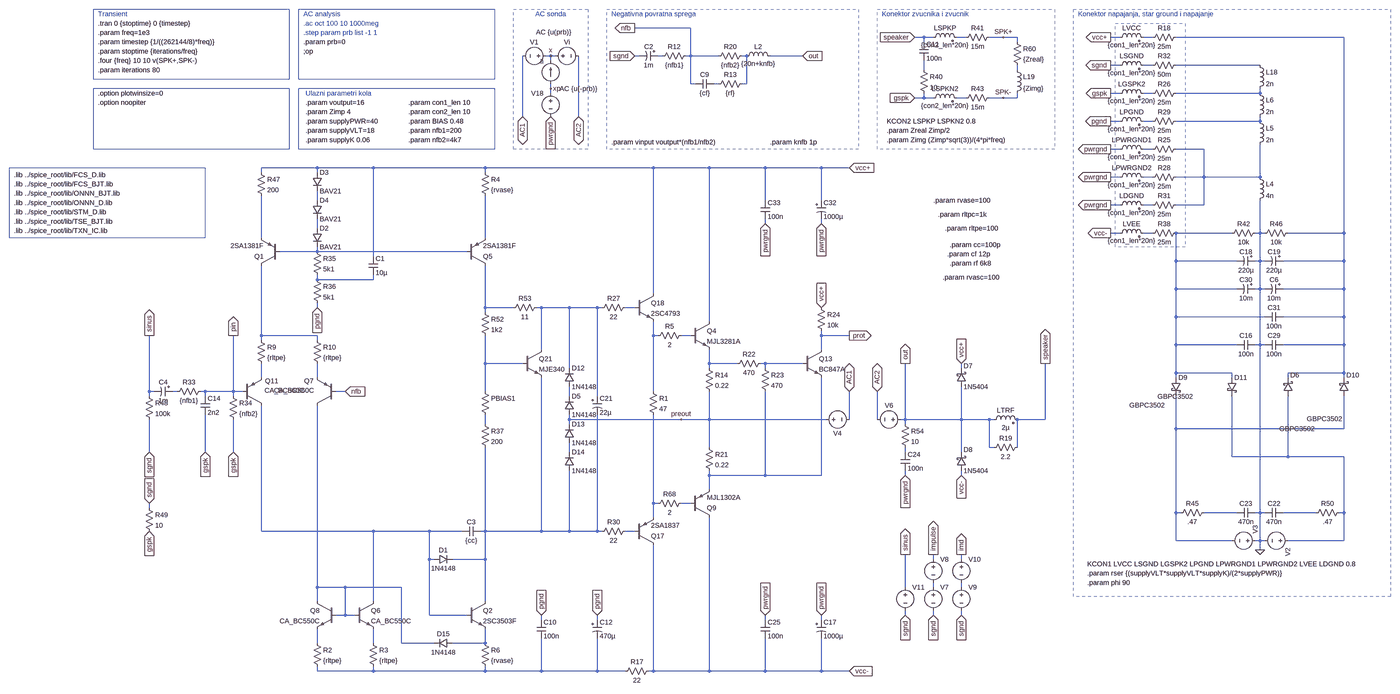
[diagram p0: schematic pab3bbb-arguo-sym.asc, whole sheet]
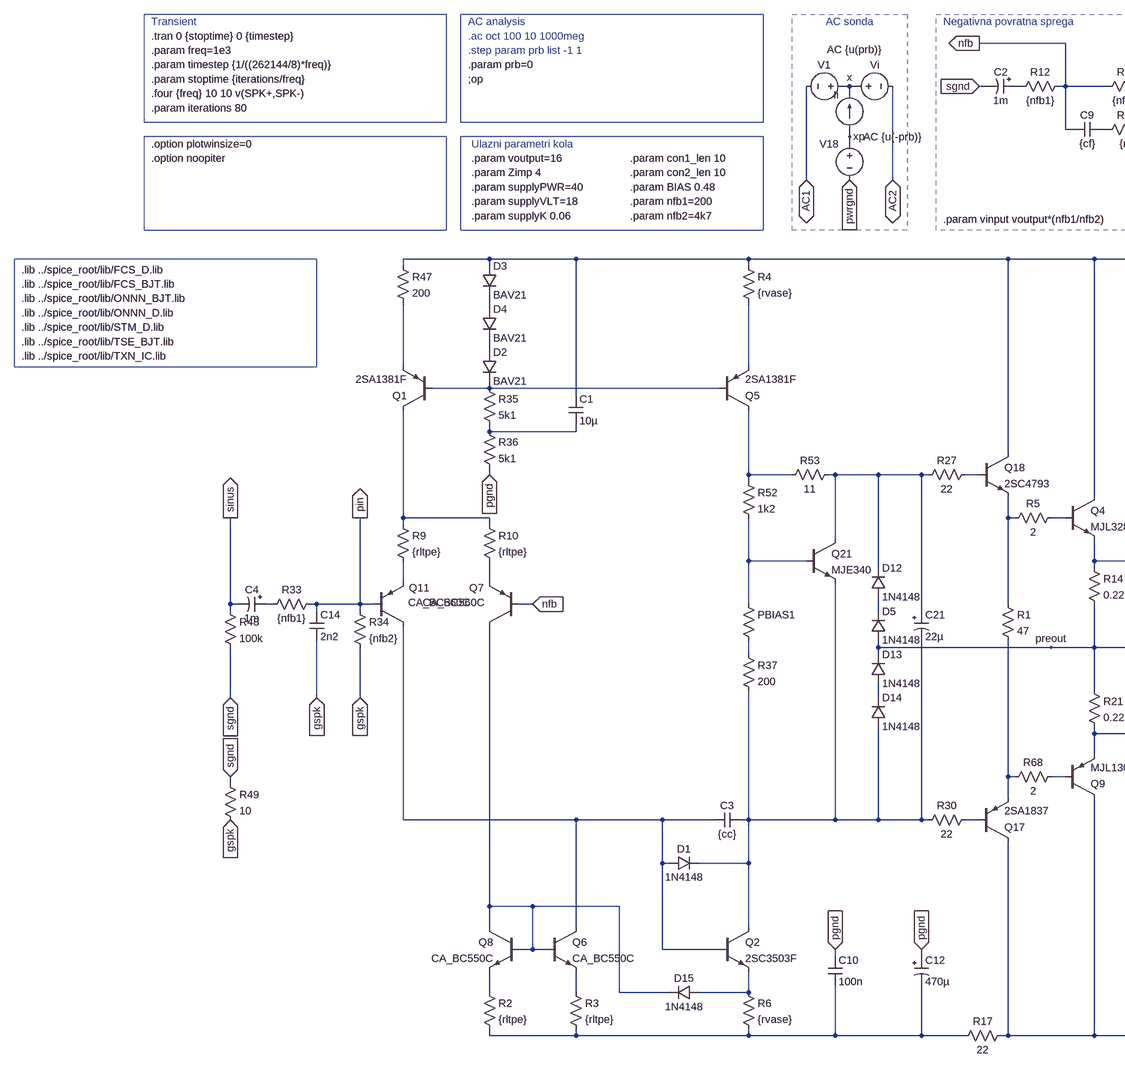
[diagram p1: schematic pab3bbb-arguo-sym.asc, part, row 1 of 1, column 1 of 2]
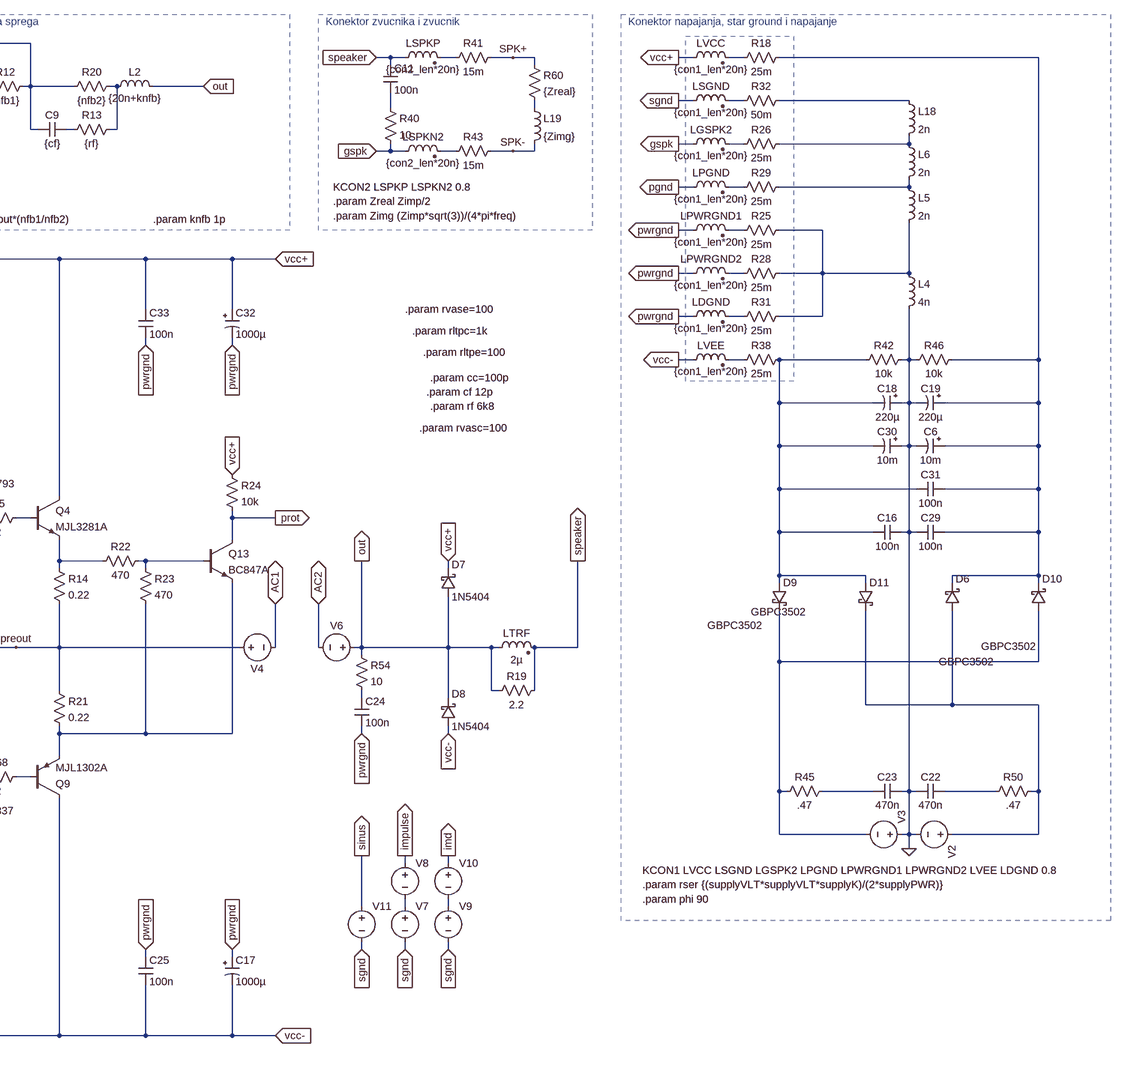
[diagram p2: schematic pab3bbb-arguo-sym.asc, part, row 1 of 1, column 2 of 2]
pab3bbb-arguo-sym.asc, the LTspice schematic file:
Version 4
SHEET 1 6124 2336
WIRE 1472 -1568 1280 -1568
WIRE 2272 -1536 2240 -1536
WIRE 2304 -1536 2272 -1536
WIRE 2416 -1536 2384 -1536
WIRE 2544 -1536 2496 -1536
WIRE 2592 -1536 2544 -1536
WIRE 2944 -1536 2912 -1536
WIRE 3056 -1536 3024 -1536
WIRE 3712 -1536 3136 -1536
WIRE 2272 -1520 2272 -1536
WIRE 2592 -1520 2592 -1536
WIRE 992 -1472 976 -1472
WIRE 1008 -1472 992 -1472
WIRE 1296 -1472 1280 -1472
WIRE 1376 -1472 1360 -1472
WIRE 1472 -1472 1472 -1568
WIRE 1472 -1472 1456 -1472
WIRE 1568 -1472 1472 -1472
WIRE 1664 -1472 1648 -1472
WIRE 1856 -1472 1744 -1472
WIRE 992 -1456 992 -1472
WIRE 2944 -1440 2912 -1440
WIRE 3056 -1440 3024 -1440
WIRE 3424 -1440 3136 -1440
WIRE 2272 -1424 2272 -1456
WIRE 2592 -1424 2592 -1440
WIRE 1472 -1376 1472 -1472
WIRE 1488 -1376 1472 -1376
WIRE 1568 -1376 1552 -1376
WIRE 1664 -1376 1664 -1472
WIRE 1664 -1376 1648 -1376
WIRE 992 -1360 992 -1376
WIRE 992 -1344 992 -1360
WIRE 2944 -1344 2912 -1344
WIRE 3056 -1344 3024 -1344
WIRE 3424 -1344 3424 -1360
WIRE 3424 -1344 3136 -1344
WIRE 2272 -1328 2272 -1344
WIRE 2272 -1328 2240 -1328
WIRE 2304 -1328 2272 -1328
WIRE 2416 -1328 2384 -1328
WIRE 2544 -1328 2496 -1328
WIRE 2592 -1328 2592 -1344
WIRE 2592 -1328 2544 -1328
WIRE 896 -1264 896 -1472
WIRE 1088 -1264 1088 -1472
WIRE 2944 -1248 2912 -1248
WIRE 3056 -1248 3024 -1248
WIRE 3424 -1248 3424 -1264
WIRE 3424 -1248 3136 -1248
WIRE 2944 -1152 2912 -1152
WIRE 3056 -1152 3024 -1152
WIRE 3232 -1152 3136 -1152
WIRE 192 -1088 0 -1088
WIRE 384 -1088 192 -1088
WIRE 768 -1088 384 -1088
WIRE 1344 -1088 768 -1088
WIRE 1536 -1088 1344 -1088
WIRE 1728 -1088 1536 -1088
WIRE 1920 -1088 1728 -1088
WIRE 2016 -1088 1920 -1088
WIRE 0 -1072 0 -1088
WIRE 192 -1072 192 -1088
WIRE 768 -1072 768 -1088
WIRE 2944 -1056 2912 -1056
WIRE 3056 -1056 3024 -1056
WIRE 3232 -1056 3232 -1152
WIRE 3232 -1056 3136 -1056
WIRE 3424 -1056 3424 -1168
WIRE 3424 -1056 3232 -1056
WIRE 192 -976 192 -1008
WIRE 1728 -976 1728 -1088
WIRE 1920 -976 1920 -1088
WIRE 2944 -960 2912 -960
WIRE 3056 -960 3024 -960
WIRE 3232 -960 3232 -1056
WIRE 3232 -960 3136 -960
WIRE 1728 -896 1728 -912
WIRE 1920 -896 1920 -912
WIRE 192 -880 192 -912
WIRE 2944 -864 2912 -864
WIRE 3056 -864 3024 -864
WIRE 3328 -864 3136 -864
WIRE 3424 -864 3424 -976
WIRE 3424 -864 3408 -864
WIRE 3440 -864 3424 -864
WIRE 3712 -864 3712 -1536
WIRE 3712 -864 3520 -864
WIRE 0 -848 0 -992
WIRE 768 -848 768 -992
WIRE 192 -800 192 -816
WIRE 192 -800 64 -800
WIRE 704 -800 192 -800
WIRE 384 -784 384 -1088
WIRE 3136 -768 3136 -864
WIRE 3344 -768 3136 -768
WIRE 3424 -768 3424 -864
WIRE 3424 -768 3408 -768
WIRE 3440 -768 3424 -768
WIRE 3712 -768 3712 -864
WIRE 3712 -768 3504 -768
WIRE 192 -704 192 -720
WIRE 384 -704 384 -720
WIRE 384 -704 192 -704
WIRE 3136 -672 3136 -768
WIRE 3344 -672 3136 -672
WIRE 3424 -672 3424 -768
WIRE 3424 -672 3408 -672
WIRE 3440 -672 3424 -672
WIRE 3712 -672 3712 -768
WIRE 3712 -672 3504 -672
WIRE 1344 -656 1344 -1088
WIRE 192 -608 192 -624
WIRE 768 -608 768 -752
WIRE 864 -608 768 -608
WIRE 960 -608 944 -608
WIRE 1056 -608 960 -608
WIRE 1152 -608 1056 -608
WIRE 1168 -608 1152 -608
WIRE 1280 -608 1248 -608
WIRE 768 -592 768 -608
WIRE 3136 -576 3136 -672
WIRE 3440 -576 3136 -576
WIRE 3712 -576 3712 -672
WIRE 3712 -576 3504 -576
WIRE 1536 -560 1536 -1088
WIRE 0 -512 0 -752
WIRE 192 -512 0 -512
WIRE 1344 -512 1344 -560
WIRE 1360 -512 1344 -512
WIRE 1472 -512 1440 -512
WIRE 1920 -512 1920 -528
WIRE 2016 -512 1920 -512
WIRE 0 -496 0 -512
WIRE 192 -496 192 -512
WIRE 3136 -480 3136 -576
WIRE 3344 -480 3136 -480
WIRE 3424 -480 3424 -672
WIRE 3424 -480 3408 -480
WIRE 3440 -480 3424 -480
WIRE 3712 -480 3712 -576
WIRE 3712 -480 3504 -480
WIRE 960 -464 960 -608
WIRE 1920 -464 1920 -512
WIRE 768 -416 768 -512
WIRE 896 -416 768 -416
WIRE 1536 -416 1536 -464
WIRE 1632 -416 1536 -416
WIRE 1728 -416 1712 -416
WIRE 1856 -416 1728 -416
WIRE 1056 -400 1056 -608
WIRE 1536 -400 1536 -416
WIRE 1728 -400 1728 -416
WIRE 2400 -400 2400 -416
WIRE 3136 -384 3136 -480
WIRE 3328 -384 3136 -384
WIRE 3712 -384 3712 -480
WIRE 3712 -384 3520 -384
WIRE 0 -368 0 -416
WIRE 192 -368 192 -416
WIRE 3136 -368 3136 -384
WIRE 3328 -368 3328 -384
WIRE 3520 -368 3520 -384
WIRE 3712 -368 3712 -384
WIRE -384 -320 -384 -512
WIRE -368 -320 -384 -320
WIRE -288 -320 -304 -320
WIRE -192 -320 -208 -320
WIRE -96 -320 -96 -512
WIRE -96 -320 -192 -320
WIRE -64 -320 -96 -320
WIRE 288 -320 256 -320
WIRE 768 -320 768 -416
WIRE 1344 -320 1344 -512
WIRE -384 -304 -384 -320
WIRE -192 -304 -192 -320
WIRE -96 -304 -96 -320
WIRE 1056 -304 1056 -336
WIRE 1152 -304 1152 -608
WIRE 1056 -224 1056 -240
WIRE 1440 -224 1056 -224
WIRE 1536 -224 1536 -320
WIRE 1536 -224 1440 -224
WIRE 1936 -224 1536 -224
WIRE 2016 -224 2016 -320
WIRE 2112 -224 2112 -320
WIRE 2208 -224 2208 -416
WIRE 2208 -224 2192 -224
WIRE 2400 -224 2400 -336
WIRE 2400 -224 2208 -224
WIRE 2496 -224 2400 -224
WIRE 2512 -224 2496 -224
WIRE 2688 -224 2688 -416
WIRE 2688 -224 2592 -224
WIRE 768 -208 768 -240
WIRE 1056 -208 1056 -224
WIRE 2208 -208 2208 -224
WIRE 3136 -192 3136 -304
WIRE 3712 -192 3712 -304
WIRE 3712 -192 3136 -192
WIRE 1536 -128 1536 -224
WIRE 2496 -128 2496 -224
WIRE 2512 -128 2496 -128
WIRE 2592 -128 2592 -224
WIRE -384 -112 -384 -224
WIRE -192 -112 -192 -240
WIRE -96 -112 -96 -224
WIRE 1056 -112 1056 -144
WIRE 2208 -112 2208 -128
WIRE 2400 -112 2400 -224
WIRE 3328 -96 3328 -304
WIRE 3520 -96 3520 -304
WIRE 3520 -96 3328 -96
WIRE 3712 -96 3520 -96
WIRE 1536 -32 1536 -48
WIRE 1728 -32 1728 -320
WIRE 1728 -32 1536 -32
WIRE 1920 -32 1920 -368
WIRE 1920 -32 1728 -32
WIRE 2208 -32 2208 -48
WIRE 2400 -32 2400 -48
WIRE 1536 16 1536 -32
WIRE 1344 64 1344 -240
WIRE 1360 64 1344 64
WIRE 1472 64 1440 64
WIRE -384 80 -384 64
WIRE 3136 96 3136 -192
WIRE 3152 96 3136 96
WIRE 3344 96 3232 96
WIRE 3424 96 3424 -480
WIRE 3424 96 3408 96
WIRE 3440 96 3424 96
WIRE 3616 96 3504 96
WIRE 3712 96 3712 -96
WIRE 3712 96 3696 96
WIRE 1344 112 1344 64
WIRE 0 160 0 -272
WIRE 384 160 0 160
WIRE 576 160 384 160
WIRE 688 160 576 160
WIRE 768 160 768 -128
WIRE 768 160 752 160
WIRE 960 160 960 -368
WIRE 960 160 768 160
WIRE 1056 160 1056 -48
WIRE 1056 160 960 160
WIRE 1152 160 1152 -240
WIRE 1152 160 1056 160
WIRE 1168 160 1152 160
WIRE 1280 160 1248 160
WIRE 3136 192 3136 96
WIRE 3328 192 3136 192
WIRE 3424 192 3424 96
WIRE 3424 192 3408 192
WIRE 3440 192 3424 192
WIRE 3712 192 3712 96
WIRE 3712 192 3520 192
WIRE 3424 224 3424 192
WIRE 576 256 576 160
WIRE 592 256 576 256
WIRE 768 256 768 160
WIRE 768 256 656 256
WIRE 2304 256 2304 240
WIRE 2400 256 2400 240
WIRE 192 352 192 -272
WIRE 288 352 192 352
WIRE 480 352 288 352
WIRE 2208 352 2208 240
WIRE 2304 352 2304 336
WIRE 2400 352 2400 336
WIRE 192 400 192 352
WIRE 384 400 384 160
WIRE 768 400 768 256
WIRE 288 448 288 352
WIRE 288 448 256 448
WIRE 320 448 288 448
WIRE 576 448 576 256
WIRE 704 448 576 448
WIRE 2208 448 2208 432
WIRE 2304 448 2304 432
WIRE 2400 448 2400 432
WIRE 960 464 960 448
WIRE 1152 464 1152 448
WIRE 1728 464 1728 448
WIRE 1920 464 1920 448
WIRE 192 544 192 496
WIRE 384 544 384 496
WIRE 480 544 480 352
WIRE 592 544 480 544
WIRE 768 544 768 496
WIRE 768 544 656 544
WIRE 192 640 192 624
WIRE 384 640 384 624
WIRE 384 640 192 640
WIRE 768 640 768 624
WIRE 768 640 384 640
WIRE 960 640 960 528
WIRE 960 640 768 640
WIRE 1152 640 1152 528
WIRE 1152 640 960 640
WIRE 1248 640 1152 640
WIRE 1344 640 1344 208
WIRE 1344 640 1328 640
WIRE 1536 640 1536 112
WIRE 1536 640 1344 640
WIRE 1728 640 1728 528
WIRE 1728 640 1536 640
WIRE 1920 640 1920 528
WIRE 1920 640 1728 640
WIRE 2016 640 1920 640
FLAG 2016 -1088 vcc+
IOPIN 2016 -1088 In
FLAG 992 -1472 x
FLAG 2016 640 vcc-
IOPIN 2016 640 In
FLAG 2208 -416 out
IOPIN 2208 -416 Out
FLAG 1280 -1568 nfb
IOPIN 1280 -1568 Out
FLAG 288 -320 nfb
IOPIN 288 -320 In
FLAG 992 -1360 xp
FLAG 2208 -32 pwrgnd
IOPIN 2208 -32 In
FLAG 1280 -1472 sgnd
IOPIN 1280 -1472 In
FLAG 2208 448 sgnd
IOPIN 2208 448 In
FLAG 2208 240 sinus
IOPIN 2208 240 Out
FLAG 192 -608 pgnd
IOPIN 192 -608 In
FLAG 2912 -1536 vcc+
IOPIN 2912 -1536 Out
FLAG 2912 -864 vcc-
IOPIN 2912 -864 Out
FLAG 2912 -1344 gspk
IOPIN 2912 -1344 Out
FLAG 2912 -1056 pwrgnd
IOPIN 2912 -1056 Out
FLAG 2912 -1248 pgnd
IOPIN 2912 -1248 Out
FLAG 2912 -1440 sgnd
IOPIN 2912 -1440 Out
FLAG 1856 -1472 out
IOPIN 1856 -1472 In
FLAG 2688 -416 speaker
IOPIN 2688 -416 Out
FLAG 2240 -1328 gspk
IOPIN 2240 -1328 In
FLAG 2240 -1536 speaker
IOPIN 2240 -1536 In
FLAG 2912 -1152 pwrgnd
IOPIN 2912 -1152 Out
FLAG 2304 240 impulse
IOPIN 2304 240 Out
FLAG 2912 -960 pwrgnd
IOPIN 2912 -960 Out
FLAG 3424 224 0
FLAG 896 -1264 AC1
IOPIN 896 -1264 BiDir
FLAG 1088 -1264 AC2
IOPIN 1088 -1264 BiDir
FLAG 2016 -320 AC1
IOPIN 2016 -320 BiDir
FLAG 2112 -320 AC2
IOPIN 2112 -320 BiDir
FLAG 992 -1264 pwrgnd
IOPIN 992 -1264 In
FLAG 2544 -1536 SPK+
FLAG 2544 -1328 SPK-
FLAG 2400 240 imd
IOPIN 2400 240 Out
FLAG 2400 -416 vcc+
IOPIN 2400 -416 In
FLAG 2400 -32 vcc-
IOPIN 2400 -32 In
FLAG 2304 448 sgnd
IOPIN 2304 448 In
FLAG 2400 448 sgnd
IOPIN 2400 448 In
FLAG 1728 448 pwrgnd
IOPIN 1728 448 In
FLAG 1920 448 pwrgnd
IOPIN 1920 448 In
FLAG 1920 -896 pwrgnd
IOPIN 1920 -896 In
FLAG 1728 -896 pwrgnd
IOPIN 1728 -896 In
FLAG -384 -112 sgnd
IOPIN -384 -112 In
FLAG -384 64 sgnd
IOPIN -384 64 In
FLAG -384 160 gspk
IOPIN -384 160 In
FLAG 1440 -224 preout
FLAG -96 -512 pin
IOPIN -96 -512 Out
FLAG 2016 -512 prot
IOPIN 2016 -512 Out
FLAG 1920 -608 vcc+
IOPIN 1920 -608 In
FLAG -384 -512 sinus
IOPIN -384 -512 Out
FLAG -96 -112 gspk
IOPIN -96 -112 In
FLAG -192 -112 gspk
IOPIN -192 -112 In
FLAG 960 448 pgnd
IOPIN 960 448 In
FLAG 1152 448 pgnd
IOPIN 1152 448 In
DATAFLAG 1440 -1088 ""
DATAFLAG 1440 640 ""
DATAFLAG 1344 -896 "Ic(Q18)"
DATAFLAG 0 -672 "-Ic(Q1)"
DATAFLAG 1632 -224 ""
DATAFLAG 1536 -896 "Ic(Q4)"
SYMBOL res 1472 -1488 R90
WINDOW 0 0 56 VBottom 2
WINDOW 3 32 56 VTop 2
SYMATTR InstName R12
SYMATTR Value {nfb1}
SYMBOL voltage 3536 192 R90
WINDOW 123 0 0 Left 2
WINDOW 3 -94 177 Invisible 2
SYMATTR Value SINE(0 {supplyVLT*sqrt(2)} 50 1m 0 {phi})
SYMATTR SpiceLine Rser={rser}
SYMATTR InstName V2
SYMBOL current 992 -1376 R180
WINDOW 0 24 77 Left 2
WINDOW 3 24 0 Invisible 2
WINDOW 123 -71 178 Left 2
WINDOW 39 0 0 Left 2
SYMATTR InstName Ii
SYMATTR Value 0
SYMATTR Value2 AC {u(prb)}
SYMBOL voltage 992 -1472 R270
WINDOW 0 32 56 VTop 2
WINDOW 3 -32 56 Invisible 2
WINDOW 123 -97 96 VBottom 2
WINDOW 39 -32 56 VBottom 2
SYMATTR InstName Vi
SYMATTR Value 0
SYMATTR Value2 AC {u(-prb)}
SYMBOL pnp -64 -272 M180
WINDOW 0 77 84 Left 2
WINDOW 3 75 52 Left 2
SYMATTR InstName Q11
SYMATTR Value CA_BC560C
SYMBOL res -304 -304 R270
WINDOW 0 32 56 VTop 2
WINDOW 3 0 56 VBottom 2
SYMATTR InstName R33
SYMATTR Value {nfb1}
SYMBOL res -112 -320 R0
SYMATTR InstName R34
SYMATTR Value {nfb2}
SYMBOL res 176 528 R0
SYMATTR InstName R2
SYMATTR Value {rltpe}
SYMBOL schottky 2384 -336 M180
WINDOW 0 24 72 Left 2
WINDOW 3 24 0 Left 2
SYMATTR InstName D7
SYMATTR Value 1N5404
SYMATTR Description Diode
SYMATTR Type diode
SYMBOL schottky 2384 -48 M180
WINDOW 0 24 72 Left 2
WINDOW 3 24 0 Left 2
SYMATTR InstName D8
SYMATTR Value 1N5404
SYMATTR Description Diode
SYMATTR Type diode
SYMBOL ind2 2496 -208 R270
WINDOW 0 32 56 VTop 2
WINDOW 3 4 56 VBottom 2
SYMATTR InstName LTRF
SYMATTR Value 2µ
SYMATTR SpiceLine Rser=10m Rpar=3meg Cpar=1p
SYMATTR Type ind
SYMBOL res 2496 -112 R270
WINDOW 0 32 56 VTop 2
WINDOW 3 0 56 VBottom 2
SYMATTR InstName R19
SYMATTR Value 2.2
SYMBOL res 1664 -1488 R90
WINDOW 0 0 56 VBottom 2
WINDOW 3 32 56 VTop 2
SYMATTR InstName R20
SYMATTR Value {nfb2}
SYMBOL voltage 992 -1472 R90
WINDOW 0 -32 56 VBottom 2
WINDOW 3 32 56 Invisible 2
WINDOW 123 0 0 Left 2
WINDOW 39 0 0 Left 2
SYMATTR InstName V1
SYMATTR Value 0
SYMBOL schottky 3504 -304 M180
WINDOW 0 24 72 Left 2
WINDOW 3 -14 -112 Left 2
SYMATTR InstName D6
SYMATTR Value GBPC3502
SYMATTR Description Diode
SYMATTR Type diode
SYMBOL schottky 3120 -368 R0
WINDOW 3 -144 95 Left 2
SYMATTR Value GBPC3502
SYMATTR InstName D9
SYMATTR Description Diode
SYMATTR Type diode
SYMBOL voltage 3424 192 M270
WINDOW 123 0 0 Left 2
WINDOW 3 -96 -62 Invisible 2
SYMATTR Value SINE(0 {supplyVLT*sqrt(2)} 50 1m 0 {phi})
SYMATTR SpiceLine Rser={rser}
SYMATTR InstName V3
SYMBOL res 2192 -224 R0
SYMATTR InstName R54
SYMATTR Value 10
SYMBOL res 2576 -1536 R0
SYMATTR InstName R60
SYMATTR Value {Zreal}
SYMBOL ind 2576 -1440 R0
SYMATTR InstName L19
SYMATTR Value {Zimg}
SYMATTR SpiceLine Cpar=10p
SYMBOL voltage 992 -1360 M0
WINDOW 123 0 0 Left 2
WINDOW 39 0 0 Left 2
WINDOW 3 24 96 Invisible 2
SYMATTR Value 0
SYMATTR InstName V18
SYMBOL pnp 1280 208 M180
SYMATTR InstName Q17
SYMATTR Value 2SA1837
SYMBOL npn 1280 -656 R0
SYMATTR InstName Q18
SYMATTR Value 2SC4793
SYMBOL res 1264 -624 R90
WINDOW 0 0 56 VBottom 2
WINDOW 3 32 56 VTop 2
SYMATTR InstName R27
SYMATTR Value 22
SYMBOL res 1264 144 R90
WINDOW 0 0 56 VBottom 2
WINDOW 3 32 56 VTop 2
SYMATTR InstName R30
SYMATTR Value 22
SYMBOL cap 2192 -112 R0
SYMATTR InstName C24
SYMATTR Value 100n
SYMATTR SpiceLine Rser=700m Lser=7n Rpar=4.4meg Cpar=1p
SYMBOL cap 1712 528 M180
WINDOW 0 24 56 Left 2
WINDOW 3 24 8 Left 2
SYMATTR InstName C25
SYMATTR Value 100n
SYMATTR SpiceLine Rser=700m Lser=7n Rpar=4.4meg Cpar=1p
SYMBOL polcap 1360 -1488 R90
WINDOW 0 0 32 VBottom 2
WINDOW 3 32 32 VTop 2
SYMATTR InstName C2
SYMATTR Value 1m
SYMATTR SpiceLine V=6.3 Irms=1.44 Rser=0.09 Lser=5.5n Rpar=1110k Cpar=3p
SYMATTR Description Capacitor
SYMATTR Type cap
SYMBOL res -16 -1088 R0
SYMATTR InstName R47
SYMATTR Value 200
SYMBOL res 752 -336 R0
WINDOW 3 36 76 Invisible 2
SYMATTR Value {1+(500*BIAS)}
SYMATTR InstName PBIAS1
SYMBOL res 752 -608 R0
SYMATTR InstName R52
SYMATTR Value 1k2
SYMBOL res 960 -624 R90
WINDOW 0 0 56 VBottom 2
WINDOW 3 32 56 VTop 2
SYMATTR InstName R53
SYMATTR Value 11
SYMBOL schottky 3696 -304 M180
WINDOW 0 24 72 Left 2
WINDOW 3 -112 -78 Left 2
SYMATTR InstName D10
SYMATTR Value GBPC3502
SYMATTR Description Diode
SYMATTR Type diode
SYMBOL schottky 3312 -368 R0
WINDOW 3 -239 65 Left 2
SYMATTR Value GBPC3502
SYMATTR InstName D11
SYMATTR Description Diode
SYMATTR Type diode
SYMBOL ind2 2928 -1520 R270
WINDOW 0 32 56 VTop 2
WINDOW 3 5 56 VBottom 2
SYMATTR InstName LVCC
SYMATTR Value {con1_len*20n}
SYMATTR SpiceLine Rser={con1_len*.5m}
SYMATTR Type ind
SYMBOL ind2 2928 -848 R270
WINDOW 0 32 56 VTop 2
WINDOW 3 5 56 VBottom 2
SYMATTR InstName LVEE
SYMATTR Value {con1_len*20n}
SYMATTR SpiceLine Rser={con1_len*.5m}
SYMATTR Type ind
SYMBOL res 752 528 R0
SYMATTR InstName R6
SYMATTR Value {rvase}
SYMBOL voltage 2208 336 R0
WINDOW 123 24 44 Left 2
WINDOW 39 0 0 Left 2
WINDOW 3 24 96 Invisible 2
SYMATTR Value SINE(0 {vinput} {freq})
SYMATTR InstName V11
SYMBOL res 1328 -336 R0
SYMATTR InstName R1
SYMATTR Value 47
SYMBOL pnp 64 -752 R180
SYMATTR InstName Q1
SYMATTR Value 2SA1381F
SYMBOL pnp 256 -272 R180
WINDOW 0 77 84 Left 2
WINDOW 3 75 52 Left 2
SYMATTR InstName Q7
SYMATTR Value CA_BC560C
SYMBOL npn 896 -464 R0
SYMATTR InstName Q21
SYMATTR Value MJE340
SYMBOL res 1344 624 R90
WINDOW 0 0 56 VBottom 2
WINDOW 3 32 56 VTop 2
SYMATTR InstName R17
SYMATTR Value 22
SYMBOL ind2 2928 -1328 R270
WINDOW 0 32 56 VTop 2
WINDOW 3 5 56 VBottom 2
SYMATTR InstName LGSPK2
SYMATTR Value {con1_len*20n}
SYMATTR SpiceLine Rser={con1_len*.5m}
SYMATTR Type ind
SYMBOL ind2 2928 -1040 R270
WINDOW 0 32 56 VTop 2
WINDOW 3 5 56 VBottom 2
SYMATTR InstName LPWRGND2
SYMATTR Value {con1_len*20n}
SYMATTR SpiceLine Rser={con1_len*.5m}
SYMATTR Type ind
SYMBOL ind2 2928 -1232 R270
WINDOW 0 32 56 VTop 2
WINDOW 3 5 56 VBottom 2
SYMATTR InstName LPGND
SYMATTR Value {con1_len*20n}
SYMATTR SpiceLine Rser={con1_len*.5m}
SYMATTR Type ind
SYMBOL ind2 2928 -1424 R270
WINDOW 0 32 56 VTop 2
WINDOW 3 5 56 VBottom 2
SYMATTR InstName LSGND
SYMATTR Value {con1_len*20n}
SYMATTR SpiceLine Rser={con1_len*.5m}
SYMATTR Type ind
SYMBOL res 3152 -1552 R90
WINDOW 0 0 56 VBottom 2
WINDOW 3 32 56 VTop 2
SYMATTR InstName R18
SYMATTR Value 25m
SYMBOL res 3152 -1360 R90
WINDOW 0 0 56 VBottom 2
WINDOW 3 32 56 VTop 2
SYMATTR InstName R26
SYMATTR Value 25m
SYMBOL res 3152 -1072 R90
WINDOW 0 0 56 VBottom 2
WINDOW 3 32 56 VTop 2
SYMATTR InstName R28
SYMATTR Value 25m
SYMBOL res 3152 -1264 R90
WINDOW 0 0 56 VBottom 2
WINDOW 3 32 56 VTop 2
SYMATTR InstName R29
SYMATTR Value 25m
SYMBOL res 3152 -1456 R90
WINDOW 0 0 56 VBottom 2
WINDOW 3 32 56 VTop 2
SYMATTR InstName R32
SYMATTR Value 50m
SYMBOL res 3152 -880 R90
WINDOW 0 0 56 VBottom 2
WINDOW 3 32 56 VTop 2
SYMATTR InstName R38
SYMATTR Value 25m
SYMBOL ind 3408 -1072 R0
SYMATTR InstName L4
SYMATTR Value 4n
SYMATTR SpiceLine Rser=1m
SYMBOL ind 3408 -1264 R0
SYMATTR InstName L5
SYMATTR Value 2n
SYMATTR SpiceLine Rser=1m
SYMBOL ind 3408 -1360 R0
SYMATTR InstName L6
SYMATTR Value 2n
SYMATTR SpiceLine Rser=1m
SYMBOL ind 3408 -1456 R0
SYMATTR InstName L18
SYMATTR Value 2n
SYMATTR SpiceLine Rser=1m
SYMBOL ind2 2288 -1520 R270
WINDOW 0 32 56 VTop 2
WINDOW 3 5 56 VBottom 2
SYMATTR InstName LSPKP
SYMATTR Value {con2_len*20n}
SYMATTR SpiceLine Rser={con2_len*.5m}
SYMATTR Type ind
SYMBOL ind2 2288 -1312 R270
WINDOW 0 32 56 VTop 2
WINDOW 3 5 56 VBottom 2
SYMATTR InstName LSPKN2
SYMATTR Value {con2_len*20n}
SYMATTR SpiceLine Rser={con2_len*.5m}
SYMATTR Type ind
SYMBOL res 2512 -1552 R90
WINDOW 0 0 56 VBottom 2
WINDOW 3 32 56 VTop 2
SYMATTR InstName R41
SYMATTR Value 15m
SYMBOL res 2512 -1344 R90
WINDOW 0 0 56 VBottom 2
WINDOW 3 32 56 VTop 2
SYMATTR InstName R43
SYMATTR Value 15m
SYMBOL ind2 2928 -944 R270
WINDOW 0 32 56 VTop 2
WINDOW 3 5 56 VBottom 2
SYMATTR InstName LDGND
SYMATTR Value {con1_len*20n}
SYMATTR SpiceLine Rser={con1_len*.5m}
SYMATTR Type ind
SYMBOL res 3152 -976 R90
WINDOW 0 0 56 VBottom 2
WINDOW 3 32 56 VTop 2
SYMATTR InstName R31
SYMATTR Value 25m
SYMBOL ind2 2928 -1136 R270
WINDOW 0 32 56 VTop 2
WINDOW 3 5 56 VBottom 2
SYMATTR InstName LPWRGND1
SYMATTR Value {con1_len*20n}
SYMATTR SpiceLine Rser={con1_len*.5m}
SYMATTR Type ind
SYMBOL res 3152 -1168 R90
WINDOW 0 0 56 VBottom 2
WINDOW 3 32 56 VTop 2
SYMATTR InstName R25
SYMATTR Value 25m
SYMBOL cap 944 464 R0
SYMATTR InstName C10
SYMATTR Value 100n
SYMATTR SpiceLine Rser=700m Lser=7n Rpar=4.4meg Cpar=1p
SYMBOL voltage 2304 336 R0
WINDOW 3 24 96 Invisible 2
WINDOW 123 0 0 Left 2
WINDOW 39 0 0 Left 2
SYMATTR Value PULSE(0 {vinput/2} 1u 1n 1n {1/(freq*2)} {1/freq})
SYMATTR InstName V7
SYMBOL voltage 2304 240 R0
WINDOW 3 24 96 Invisible 2
WINDOW 123 0 0 Left 2
WINDOW 39 0 0 Left 2
SYMATTR Value PULSE(0 {-vinput/2} {1u+(1/(freq*2))} 1n 1n {1/(freq*2)} {1/freq})
SYMATTR InstName V8
SYMBOL polcap 1136 464 R0
SYMATTR Value 470µ
SYMATTR InstName C12
SYMATTR SpiceLine V=6.3 Irms=290m Rser=0.5 Lser=3n Rpar=1100k Cpar=3p
SYMATTR Description Capacitor
SYMATTR Type cap
SYMBOL polcap 1904 464 R0
SYMATTR InstName C17
SYMATTR Value 1000µ
SYMATTR SpiceLine V=63 Irms=2.77 Rser=0.036 Lser=5n Rpar=900k Cpar=3p mfg="Nichicon" pn="UPW1J102MHD6" type="Al electrolytic"
SYMATTR Description Capacitor
SYMATTR Type cap
SYMBOL polcap 1136 -304 R0
SYMATTR InstName C21
SYMATTR Value 22µ
SYMATTR SpiceLine V=100 Irms=250m Rser=0.71 Lser=2n Rpar=2meg Cpar=2p mfg="Nichicon" pn="UPW1J220MED" type="Al electrolytic"
SYMATTR Description Capacitor
SYMATTR Type cap
SYMBOL res 752 -224 R0
SYMATTR InstName R37
SYMATTR Value 200
SYMBOL voltage 1920 -224 R270
WINDOW 0 -32 56 VBottom 2
WINDOW 3 32 56 Invisible 2
WINDOW 123 0 0 Left 2
WINDOW 39 0 0 Left 2
SYMATTR InstName V4
SYMATTR Value 0
SYMBOL voltage 2208 -224 R90
WINDOW 0 -32 56 VBottom 2
WINDOW 3 32 56 Invisible 2
WINDOW 123 0 0 Left 2
WINDOW 39 0 0 Left 2
SYMATTR InstName V6
SYMATTR Value 0
SYMBOL voltage 2400 336 R0
WINDOW 3 24 96 Invisible 2
WINDOW 123 0 0 Left 2
WINDOW 39 0 0 Left 2
SYMATTR Value SINE(0 {vinput/2} 19k)
SYMATTR InstName V9
SYMBOL voltage 2400 240 R0
WINDOW 3 24 96 Invisible 2
WINDOW 123 0 0 Left 2
WINDOW 39 0 0 Left 2
SYMATTR Value SINE(0 {vinput/2} 20k 0 0)
SYMATTR InstName V10
SYMBOL ind 1648 -1456 R270
WINDOW 0 32 56 VTop 2
WINDOW 3 5 56 VBottom 2
SYMATTR InstName L2
SYMATTR Value {20n+knfb}
SYMBOL npn 1472 -560 R0
SYMATTR InstName Q4
SYMATTR Value MJL3281A
SYMBOL pnp 1472 112 M180
SYMATTR InstName Q9
SYMATTR Value MJL1302A
SYMBOL res 1456 -528 R90
WINDOW 0 0 56 VBottom 2
WINDOW 3 32 56 VTop 2
SYMATTR InstName R5
SYMATTR Value 2
SYMBOL res 1456 48 R90
WINDOW 0 0 56 VBottom 2
WINDOW 3 32 56 VTop 2
SYMATTR InstName R68
SYMATTR Value 2
SYMBOL res 1664 -1392 R90
WINDOW 0 0 56 VBottom 2
WINDOW 3 32 56 VTop 2
SYMATTR InstName R13
SYMATTR Value {rf}
SYMBOL cap 1552 -1392 R90
WINDOW 0 0 32 VBottom 2
WINDOW 3 32 32 VTop 2
SYMATTR InstName C9
SYMATTR Value {cf}
SYMATTR SpiceLine Rser=140m Lser=3n Rpar=7.4meg
SYMBOL cap 368 -784 R0
SYMATTR InstName C1
SYMATTR Value 10µ
SYMATTR SpiceLine Rser=700m Lser=7n Rpar=4.4meg Cpar=1p
SYMBOL res 1520 -416 R0
SYMATTR InstName R14
SYMATTR Value 0.22
SYMBOL res 1520 -144 R0
SYMATTR InstName R21
SYMATTR Value 0.22
SYMBOL polcap 3408 -784 R90
WINDOW 0 0 32 VBottom 2
WINDOW 3 32 32 VTop 2
SYMATTR InstName C18
SYMATTR Value 220µ
SYMATTR SpiceLine V=50 Irms=1.04 Rser=0.075 Lser=0 Rpar=40k Cpar=3p mfg="Nichicon" pn="UPL1H221MPH" type="Al electrolytic"
SYMATTR Description Capacitor
SYMATTR Type cap
SYMBOL polcap 3504 -784 R90
WINDOW 0 0 32 VBottom 2
WINDOW 3 32 32 VTop 2
SYMATTR InstName C19
SYMATTR Value 220µ
SYMATTR SpiceLine V=50 Irms=1.04 Rser=0.075 Lser=0 Rpar=40k Cpar=3p mfg="Nichicon" pn="UPL1H221MPH" type="Al electrolytic"
SYMATTR Description Capacitor
SYMATTR Type cap
SYMBOL cap 3440 80 M90
WINDOW 0 0 32 VBottom 2
WINDOW 3 32 32 VTop 2
SYMATTR InstName C22
SYMATTR Value 470n
SYMATTR SpiceLine Rser=700m Lser=7n Rpar=4.4meg Cpar=1p
SYMBOL cap 3344 80 M90
WINDOW 0 0 32 VBottom 2
WINDOW 3 32 32 VTop 2
SYMATTR InstName C23
SYMATTR Value 470n
SYMATTR SpiceLine Rser=700m Lser=7n Rpar=4.4meg Cpar=1p
SYMBOL polcap 3408 -688 R90
WINDOW 0 0 32 VBottom 2
WINDOW 3 32 32 VTop 2
SYMATTR InstName C30
SYMATTR Value 10m
SYMATTR SpiceLine V=50 Irms=2.5 Rser=0.08 Lser=20n Rpar=40k Cpar=3p
SYMATTR Description Capacitor
SYMATTR Type cap
SYMBOL polcap 3504 -688 R90
WINDOW 0 0 32 VBottom 2
WINDOW 3 32 32 VTop 2
SYMATTR InstName C6
SYMATTR Value 10m
SYMATTR SpiceLine V=50 Irms=2.5 Rser=0.08 Lser=20n Rpar=40k Cpar=3p
SYMATTR Description Capacitor
SYMATTR Type cap
SYMBOL res 3424 -880 R90
WINDOW 0 0 56 VBottom 2
WINDOW 3 32 56 VTop 2
SYMATTR InstName R42
SYMATTR Value 10k
SYMBOL res 3536 -880 R90
WINDOW 0 0 56 VBottom 2
WINDOW 3 32 56 VTop 2
SYMATTR InstName R46
SYMATTR Value 10k
SYMBOL cap 3344 -496 M90
WINDOW 0 0 32 VBottom 2
WINDOW 3 32 32 VTop 2
SYMATTR InstName C16
SYMATTR Value 100n
SYMATTR SpiceLine Rser=700m Lser=7n Rpar=4.4meg Cpar=1p
SYMBOL cap 3440 -496 M90
WINDOW 0 0 32 VBottom 2
WINDOW 3 32 32 VTop 2
SYMATTR InstName C29
SYMATTR Value 100n
SYMATTR SpiceLine Rser=700m Lser=7n Rpar=4.4meg Cpar=1p
SYMBOL cap 3440 -592 M90
WINDOW 0 0 32 VBottom 2
WINDOW 3 32 32 VTop 2
SYMATTR InstName C31
SYMATTR Value 100n
SYMATTR SpiceLine Rser=700m Lser=7n Rpar=4.4meg Cpar=1p
SYMBOL polcap 1904 -976 R0
SYMATTR InstName C32
SYMATTR Value 1000µ
SYMATTR SpiceLine V=63 Irms=2.77 Rser=0.036 Lser=5n Rpar=900k Cpar=3p mfg="Nichicon" pn="UPW1J102MHD6" type="Al electrolytic"
SYMATTR Description Capacitor
SYMATTR Type cap
SYMBOL cap 1712 -976 R0
SYMATTR InstName C33
SYMATTR Value 100n
SYMATTR SpiceLine Rser=700m Lser=7n Rpar=4.4meg Cpar=1p
SYMBOL res -400 -320 R0
SYMATTR InstName R48
SYMATTR Value 100k
SYMBOL res -400 64 R0
SYMATTR InstName R49
SYMATTR Value 10
SYMBOL npn 1856 -464 R0
SYMATTR InstName Q13
SYMATTR Value BC847A
SYMBOL res 1728 -432 R90
WINDOW 0 0 56 VBottom 2
WINDOW 3 32 56 VTop 2
SYMATTR InstName R22
SYMATTR Value 470
SYMBOL res 1712 -416 R0
SYMATTR InstName R23
SYMATTR Value 470
SYMBOL res 1904 -624 R0
SYMATTR InstName R24
SYMATTR Value 10k
SYMBOL res 176 -816 R0
SYMATTR InstName R35
SYMATTR Value 5k1
SYMBOL res 176 -720 R0
SYMATTR InstName R36
SYMATTR Value 5k1
SYMBOL cap -208 -240 M180
WINDOW 0 24 56 Left 2
WINDOW 3 24 8 Left 2
SYMATTR InstName C14
SYMATTR Value 2n2
SYMATTR SpiceLine Rser=140m Lser=3n Rpar=7.4meg
SYMBOL polcap -304 -336 R90
WINDOW 0 0 32 VBottom 2
WINDOW 3 32 32 VTop 2
SYMATTR InstName C4
SYMATTR Value 1m
SYMATTR SpiceLine V=6.3 Irms=1.44 Rser=0.09 Lser=5.5n Rpar=1110k Cpar=3p
SYMATTR Description Capacitor
SYMATTR Type cap
SYMBOL cap 2256 -1520 R0
SYMATTR InstName C11
SYMATTR Value 100n
SYMBOL res 2256 -1440 R0
SYMATTR InstName R40
SYMATTR Value 10
SYMBOL res 3248 80 R90
WINDOW 0 0 56 VBottom 2
WINDOW 3 32 56 VTop 2
SYMATTR InstName R45
SYMATTR Value .47
SYMBOL res 3712 80 R90
WINDOW 0 0 56 VBottom 2
WINDOW 3 32 56 VTop 2
SYMATTR InstName R50
SYMATTR Value .47
SYMBOL npn 320 400 R0
SYMATTR InstName Q6
SYMATTR Value CA_BC550C
SYMBOL npn 256 400 M0
SYMATTR InstName Q8
SYMATTR Value CA_BC550C
SYMBOL res 368 528 R0
SYMATTR InstName R3
SYMATTR Value {rltpe}
SYMBOL res 752 -1088 R0
SYMATTR InstName R4
SYMATTR Value {rvase}
SYMBOL diode 176 -1072 R0
SYMATTR InstName D3
SYMATTR Value BAV21
SYMBOL diode 176 -976 R0
SYMATTR InstName D4
SYMATTR Value BAV21
SYMBOL res -16 -512 R0
SYMATTR InstName R9
SYMATTR Value {rltpe}
SYMBOL res 176 -512 R0
SYMATTR InstName R10
SYMATTR Value {rltpe}
SYMBOL npn 704 400 R0
SYMATTR InstName Q2
SYMATTR Value 2SC3503F
SYMBOL pnp 704 -752 M180
SYMATTR InstName Q5
SYMATTR Value 2SA1381F
SYMBOL cap 752 144 R90
WINDOW 0 0 32 VBottom 2
WINDOW 3 32 32 VTop 2
SYMATTR InstName C3
SYMATTR Value {cc}
SYMATTR SpiceLine Rser=140m Lser=3n Rpar=7.4meg
SYMBOL diode 592 272 R270
WINDOW 0 32 32 VTop 2
WINDOW 3 0 32 VBottom 2
SYMATTR InstName D1
SYMATTR Value 1N4148
SYMBOL diode 176 -880 R0
SYMATTR InstName D2
SYMATTR Value BAV21
SYMBOL diode 1040 -240 M180
WINDOW 0 24 64 Left 2
WINDOW 3 24 0 Left 2
SYMATTR InstName D5
SYMATTR Value 1N4148
SYMBOL diode 1040 -336 M180
WINDOW 0 24 64 Left 2
WINDOW 3 24 0 Left 2
SYMATTR InstName D12
SYMATTR Value 1N4148
SYMBOL diode 1040 -144 M180
WINDOW 0 24 64 Left 2
WINDOW 3 24 0 Left 2
SYMATTR InstName D13
SYMATTR Value 1N4148
SYMBOL diode 1040 -48 M180
WINDOW 0 24 64 Left 2
WINDOW 3 24 0 Left 2
SYMATTR InstName D14
SYMATTR Value 1N4148
SYMBOL diode 656 528 R90
WINDOW 0 0 32 VBottom 2
WINDOW 3 32 32 VTop 2
SYMATTR InstName D15
SYMATTR Value 1N4148
TEXT 144 -1488 Left 2 !;op
TEXT -560 -1344 Left 2 !.option plotwinsize=0
TEXT -560 -1312 Left 2 !.option noopiter
TEXT -560 -1616 Left 2 ;Transient
TEXT -560 -1456 Left 2 !.four {freq} 10 10 v(SPK+,SPK-)
TEXT 144 -1520 Left 2 !.param prb=0
TEXT -560 -1520 Left 2 !.param timestep {1/((262144/8)*freq)}
TEXT -560 -1552 Left 2 !.param freq=1e3
TEXT -560 -1488 Left 2 !.param stoptime {iterations/freq}
TEXT 144 -1584 Left 2 ;.ac oct 100 10 1000meg
TEXT 144 -1552 Left 2 ;.step param prb list -1 1
TEXT 144 -1616 Left 2 ;AC analysis
TEXT -560 -1424 Left 2 !.param iterations 80
TEXT 152 -1280 Left 2 !.param Zimp 4
TEXT 2144 -1216 Left 2 !.param Zreal Zimp/2
TEXT 2144 -1184 Left 2 !.param Zimg (Zimp*sqrt(3))/(4*pi*freq)
TEXT 152 -1248 Left 2 !.param supplyPWR=40
TEXT 152 -1216 Left 2 !.param supplyVLT=18
TEXT 152 -1312 Left 2 !.param voutput=16
TEXT 152 -1184 Left 2 !.param supplyK 0.06
TEXT 2832 304 Left 2 !.param rser {(supplyVLT*supplyVLT*supplyK)/(2*supplyPWR)}
TEXT -560 -1584 Left 2 !.tran 0 {stoptime} 0 {timestep}
TEXT 2832 336 Left 2 !.param phi 90
TEXT 504 -1312 Left 2 !.param con1_len 10
TEXT 2832 272 Left 2 !KCON1 LVCC LSGND LGSPK2 LPGND LPWRGND1 LPWRGND2 LVEE LDGND 0.8
TEXT 504 -1280 Left 2 !.param con2_len 10
TEXT 2144 -1248 Left 2 !KCON2 LSPKP LSPKN2 0.8
TEXT 2128 -1616 Left 2 ;Konektor zvucnika i zvucnik
TEXT 2800 -1616 Left 2 ;Konektor napajanja, star ground i napajanje
TEXT 1200 -1616 Left 2 ;Negativna povratna sprega
TEXT 152 -1344 Left 2 ;Ulazni parametri kola
TEXT 992 -1616 Center 2 ;AC sonda
TEXT 504 -1248 Left 2 !.param BIAS 0.48
TEXT 1744 -1176 Left 2 !.param knfb 1p
TEXT 1200 -1176 Left 2 !.param vinput voutput*(nfb1/nfb2)
TEXT 504 -1216 Left 2 !.param nfb1=200
TEXT 504 -1184 Left 2 !.param nfb2=4k7
TEXT 2352 -792 Left 2 !.param cf 12p
TEXT 2360 -760 Left 2 !.param rf 6k8
TEXT 2304 -976 Left 2 !.param rvase=100
TEXT 2320 -928 Left 2 !.param rltpc=1k
TEXT 2344 -880 Left 2 !.param rltpe=100
TEXT 2360 -824 Left 2 !.param cc=100p
TEXT 2336 -712 Left 2 !.param rvasc=100
TEXT -848 -1000 Left 2 !.lib ../spice_root/lib/ONNN_BJT.lib
TEXT -848 -936 Left 2 !.lib ../spice_root/lib/STM_D.lib
TEXT -848 -1032 Left 2 !.lib ../spice_root/lib/FCS_BJT.lib
TEXT -848 -1064 Left 2 !.lib ../spice_root/lib/FCS_D.lib
TEXT -848 -968 Left 2 !.lib ../spice_root/lib/ONNN_D.lib
TEXT -848 -904 Left 2 !.lib ../spice_root/lib/TSE_BJT.lib
TEXT -848 -872 Left 2 !.lib ../spice_root/lib/TXN_IC.lib
RECTANGLE Normal 96 -1632 -576 -1392
RECTANGLE Normal 96 -1152 -576 -1360
RECTANGLE Normal 800 -1632 128 -1392
RECTANGLE Normal 2720 -1152 2112 -1632 2
RECTANGLE Normal 1120 -1152 864 -1632 2
RECTANGLE Normal 3168 -816 2928 -1584 2
RECTANGLE Normal 2048 -1152 1184 -1632 2
RECTANGLE Normal 800 -1152 128 -1360
RECTANGLE Normal 3872 384 2784 -1632 2
RECTANGLE Normal -192 -848 -864 -1088

The netlist it stands for:
* pab3bbb-arguo-sym.asc
R12 nfb N004 {nfb1}
V2 N045 0 SINE(0 {supplyVLT*sqrt(2)} 50 1m 0 {phi}) Rser={rser}
Ii xp x 0 AC {u(prb)}
Vi x AC2 0 AC {u(-prb)}
Q11 N051 pin N037 0 CA_BC560C
R33 N039 pin {nfb1}
R34 pin gspk {nfb2}
R2 N057 N060 {rltpe}
D7 out vcc+ 1N5404
D8 vcc- out 1N5404
LTRF out speaker 2µ Rser=10m Rpar=3meg Cpar=1p
R19 out speaker 2.2
R20 N005 nfb {nfb2}
V1 x AC1 0
D6 N045 N003 GBPC3502
D9 N023 N042 GBPC3502
V3 0 N042 SINE(0 {supplyVLT*sqrt(2)} 50 1m 0 {phi}) Rser={rser}
R54 out N044 10
R60 SPK+ N009 {Zreal}
L19 N009 SPK- {Zimg} Cpar=10p
V18 xp pwrgnd 0
Q17 vcc- N053 N047 0 2SA1837
Q18 vcc+ N030 N032 0 2SC4793
R27 N030 N029 22
R30 N053 N052 22
C24 N044 pwrgnd 100n Rser=700m Lser=7n Rpar=4.4meg Cpar=1p
C25 vcc- pwrgnd 100n Rser=700m Lser=7n Rpar=4.4meg Cpar=1p
C2 N004 sgnd 1m V=6.3 Irms=1.44 Rser=0.09 Lser=5.5n Rpar=1110k Cpar=3p
R47 vcc+ N024 200
R§PBIAS1 N034 N041 {1+(500*BIAS)}
R52 N028 N034 1k2
R53 N029 N028 11
D10 N042 N003 GBPC3502
D11 N023 N045 GBPC3502
LVCC vcc+ N002 {con1_len*20n} Rser={con1_len*.5m}
LVEE vcc- N022 {con1_len*20n} Rser={con1_len*.5m}
R6 N059 N060 {rvase}
V11 sinus sgnd SINE(0 {vinput} {freq})
R1 N032 N047 47
Q1 N031 N026 N024 0 2SA1381F
Q7 N054 nfb N038 0 CA_BC560C
Q21 N029 N034 N052 0 MJE340
R17 vcc- N060 22
LGSPK2 gspk N011 {con1_len*20n} Rser={con1_len*.5m}
LPWRGND2 pwrgnd N018 {con1_len*20n} Rser={con1_len*.5m}
LPGND pgnd N014 {con1_len*20n} Rser={con1_len*.5m}
LSGND sgnd N006 {con1_len*20n} Rser={con1_len*.5m}
R18 N003 N002 25m
R26 N012 N011 25m
R28 N017 N018 25m
R29 N015 N014 25m
R32 N007 N006 50m
R38 N023 N022 25m
L4 N017 0 4n Rser=1m
L5 N015 N017 2n Rser=1m
L6 N012 N015 2n Rser=1m
L18 N007 N012 2n Rser=1m
LSPKP speaker N001 {con2_len*20n} Rser={con2_len*.5m}
LSPKN2 gspk N013 {con2_len*20n} Rser={con2_len*.5m}
R41 SPK+ N001 15m
R43 SPK- N013 15m
LDGND pwrgnd N020 {con1_len*20n} Rser={con1_len*.5m}
R31 N017 N020 25m
LPWRGND1 pwrgnd N016 {con1_len*20n} Rser={con1_len*.5m}
R25 N017 N016 25m
C10 pgnd N060 100n Rser=700m Lser=7n Rpar=4.4meg Cpar=1p
V7 N055 sgnd PULSE(0 {vinput/2} 1u 1n 1n {1/(freq*2)} {1/freq})
V8 impulse N055 PULSE(0 {-vinput/2} {1u+(1/(freq*2))} 1n 1n {1/(freq*2)} {1/freq})
C12 pgnd N060 470µ V=6.3 Irms=290m Rser=0.5 Lser=3n Rpar=1100k Cpar=3p
C17 pwrgnd vcc- 1000µ V=63 Irms=2.77 Rser=0.036 Lser=5n Rpar=900k Cpar=3p mfg="Nichicon" pn="UPW1J102MHD6" type="Al electrolytic"
C21 N029 N052 22µ V=100 Irms=250m Rser=0.71 Lser=2n Rpar=2meg Cpar=2p mfg="Nichicon" pn="UPW1J220MED" type="Al electrolytic"
R37 N041 N052 200
V4 preout AC1 0
V6 out AC2 0
V9 N056 sgnd SINE(0 {vinput/2} 19k)
V10 imd N056 SINE(0 {vinput/2} 20k 0 0)
L2 N005 out {20n+knfb}
Q4 vcc+ N033 N035 0 MJL3281A
Q9 vcc- N048 N046 0 MJL1302A
R5 N033 N032 2
R68 N048 N047 2
R13 N005 N010 {rf}
C9 N010 nfb {cf} Rser=140m Lser=3n Rpar=7.4meg
C1 vcc+ N027 10µ Rser=700m Lser=7n Rpar=4.4meg Cpar=1p
R14 N035 preout 0.22
R21 preout N046 0.22
C18 0 N023 220µ V=50 Irms=1.04 Rser=0.075 Lser=0 Rpar=40k Cpar=3p mfg="Nichicon" pn="UPL1H221MPH" type="Al electrolytic"
C19 N003 0 220µ V=50 Irms=1.04 Rser=0.075 Lser=0 Rpar=40k Cpar=3p mfg="Nichicon" pn="UPL1H221MPH" type="Al electrolytic"
C22 0 N050 470n Rser=700m Lser=7n Rpar=4.4meg Cpar=1p
C23 N049 0 470n Rser=700m Lser=7n Rpar=4.4meg Cpar=1p
C30 0 N023 10m V=50 Irms=2.5 Rser=0.08 Lser=20n Rpar=40k Cpar=3p
C6 N003 0 10m V=50 Irms=2.5 Rser=0.08 Lser=20n Rpar=40k Cpar=3p
R42 0 N023 10k
R46 N003 0 10k
C16 N023 0 100n Rser=700m Lser=7n Rpar=4.4meg Cpar=1p
C29 0 N003 100n Rser=700m Lser=7n Rpar=4.4meg Cpar=1p
C31 N023 N003 100n Rser=700m Lser=7n Rpar=4.4meg Cpar=1p
C32 vcc+ pwrgnd 1000µ V=63 Irms=2.77 Rser=0.036 Lser=5n Rpar=900k Cpar=3p mfg="Nichicon" pn="UPW1J102MHD6" type="Al electrolytic"
C33 vcc+ pwrgnd 100n Rser=700m Lser=7n Rpar=4.4meg Cpar=1p
R48 sinus sgnd 100k
R49 sgnd gspk 10
Q13 prot N036 N046 0 BC847A
R22 N036 N035 470
R23 N036 N046 470
R24 vcc+ prot 10k
R35 N026 N027 5k1
R36 N027 pgnd 5k1
C14 gspk pin 2n2 Rser=140m Lser=3n Rpar=7.4meg
C4 N039 sinus 1m V=6.3 Irms=1.44 Rser=0.09 Lser=5.5n Rpar=1110k Cpar=3p
C11 speaker N008 100n
R40 N008 gspk 10
R45 N049 N042 .47
R50 N045 N050 .47
Q6 N051 N054 N058 0 CA_BC550C
Q8 N054 N054 N057 0 CA_BC550C
R3 N058 N060 {rltpe}
R4 vcc+ N025 {rvase}
D3 vcc+ N019 BAV21
D4 N019 N021 BAV21
R9 N031 N037 {rltpe}
R10 N031 N038 {rltpe}
Q2 N052 N051 N059 0 2SC3503F
Q5 N028 N026 N025 0 2SA1381F
C3 N052 N051 {cc} Rser=140m Lser=3n Rpar=7.4meg
D1 N051 N052 1N4148
D2 N021 N026 BAV21
D5 preout N040 1N4148
D12 N040 N029 1N4148
D13 N043 preout 1N4148
D14 N052 N043 1N4148
D15 N059 N054 1N4148
.model D D
.lib standard.dio
.model NPN NPN
.model PNP PNP
.lib standard.bjt
;op
.option plotwinsize=0
.option noopiter
* Transient
.four {freq} 10 10 v(SPK+,SPK-)
.param prb=0
.param timestep {1/((262144/8)*freq)}
.param freq=1e3
.param stoptime {iterations/freq}
* .ac oct 100 10 1000meg
* .step param prb list -1 1
* AC analysis
.param iterations 80
.param Zimp 4
.param Zreal Zimp/2
.param Zimg (Zimp*sqrt(3))/(4*pi*freq)
.param supplyPWR=40
.param supplyVLT=18
.param voutput=16
.param supplyK 0.06
.param rser {(supplyVLT*supplyVLT*supplyK)/(2*supplyPWR)}
.tran 0 {stoptime} 0 {timestep}
.param phi 90
.param con1_len 10
KCON1 LVCC LSGND LGSPK2 LPGND LPWRGND1 LPWRGND2 LVEE LDGND 0.8
.param con2_len 10
KCON2 LSPKP LSPKN2 0.8
* Konektor zvucnika i zvucnik
* Konektor napajanja, star ground i napajanje
* Negativna povratna sprega
* Ulazni parametri kola
* AC sonda
.param BIAS 0.48
.param knfb 1p
.param vinput voutput*(nfb1/nfb2)
.param nfb1=200
.param nfb2=4k7
.param cf 12p
.param rf 6k8
.param rvase=100
.param rltpc=1k
.param rltpe=100
.param cc=100p
.param rvasc=100
.lib ../spice_root/lib/ONNN_BJT.lib
.lib ../spice_root/lib/STM_D.lib
.lib ../spice_root/lib/FCS_BJT.lib
.lib ../spice_root/lib/FCS_D.lib
.lib ../spice_root/lib/ONNN_D.lib
.lib ../spice_root/lib/TSE_BJT.lib
.lib ../spice_root/lib/TXN_IC.lib
.backanno
.end